# EAGLE design draftBoard (EAGLE 6.6.0)
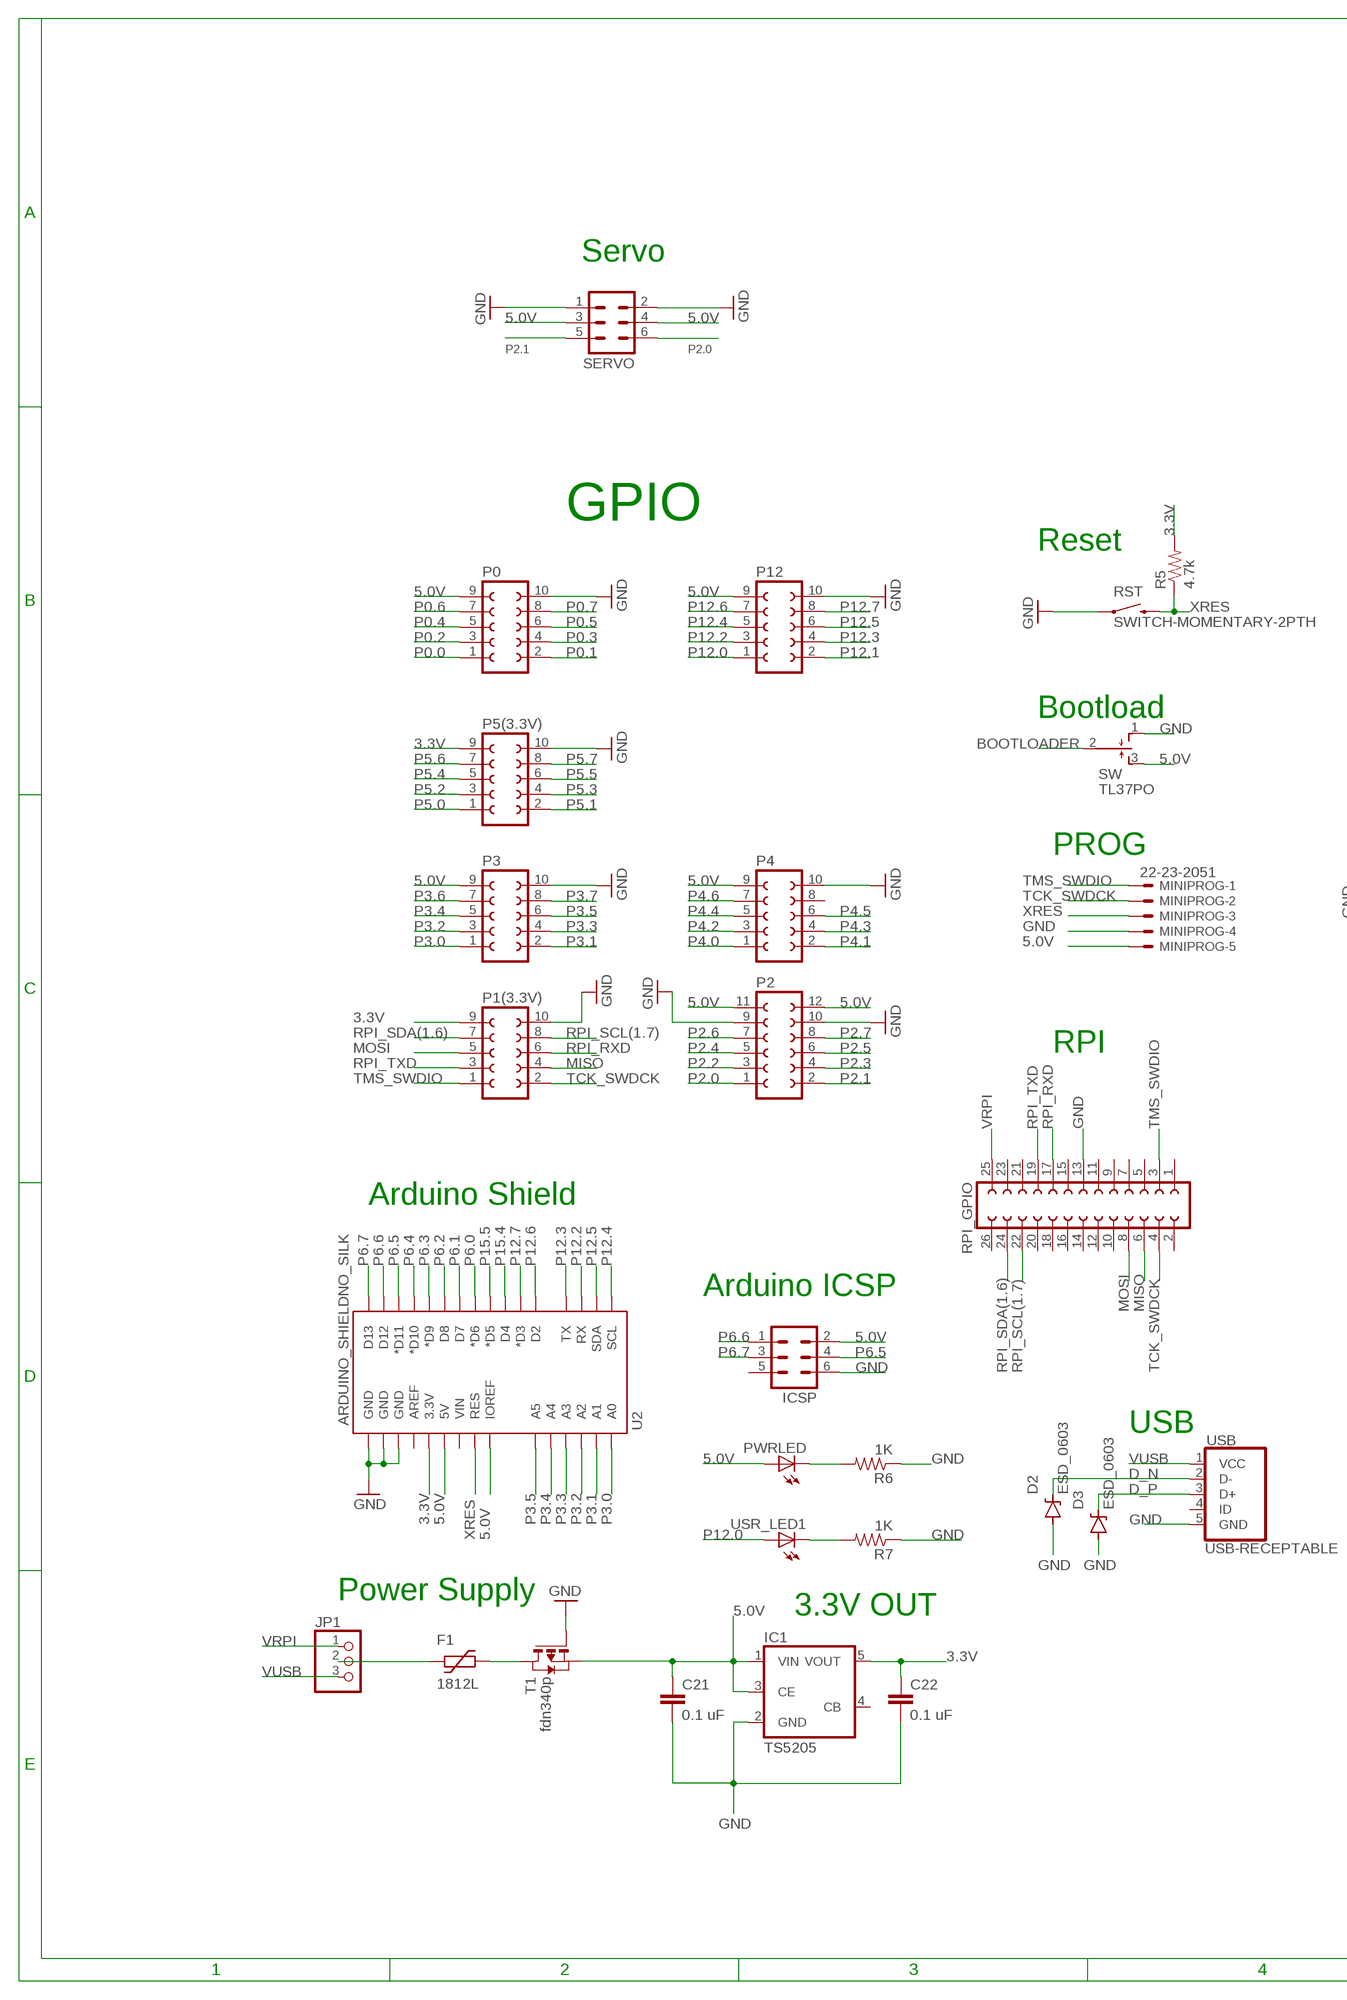
[diagram p0: schematic, sheet 1, part 1 of 2]
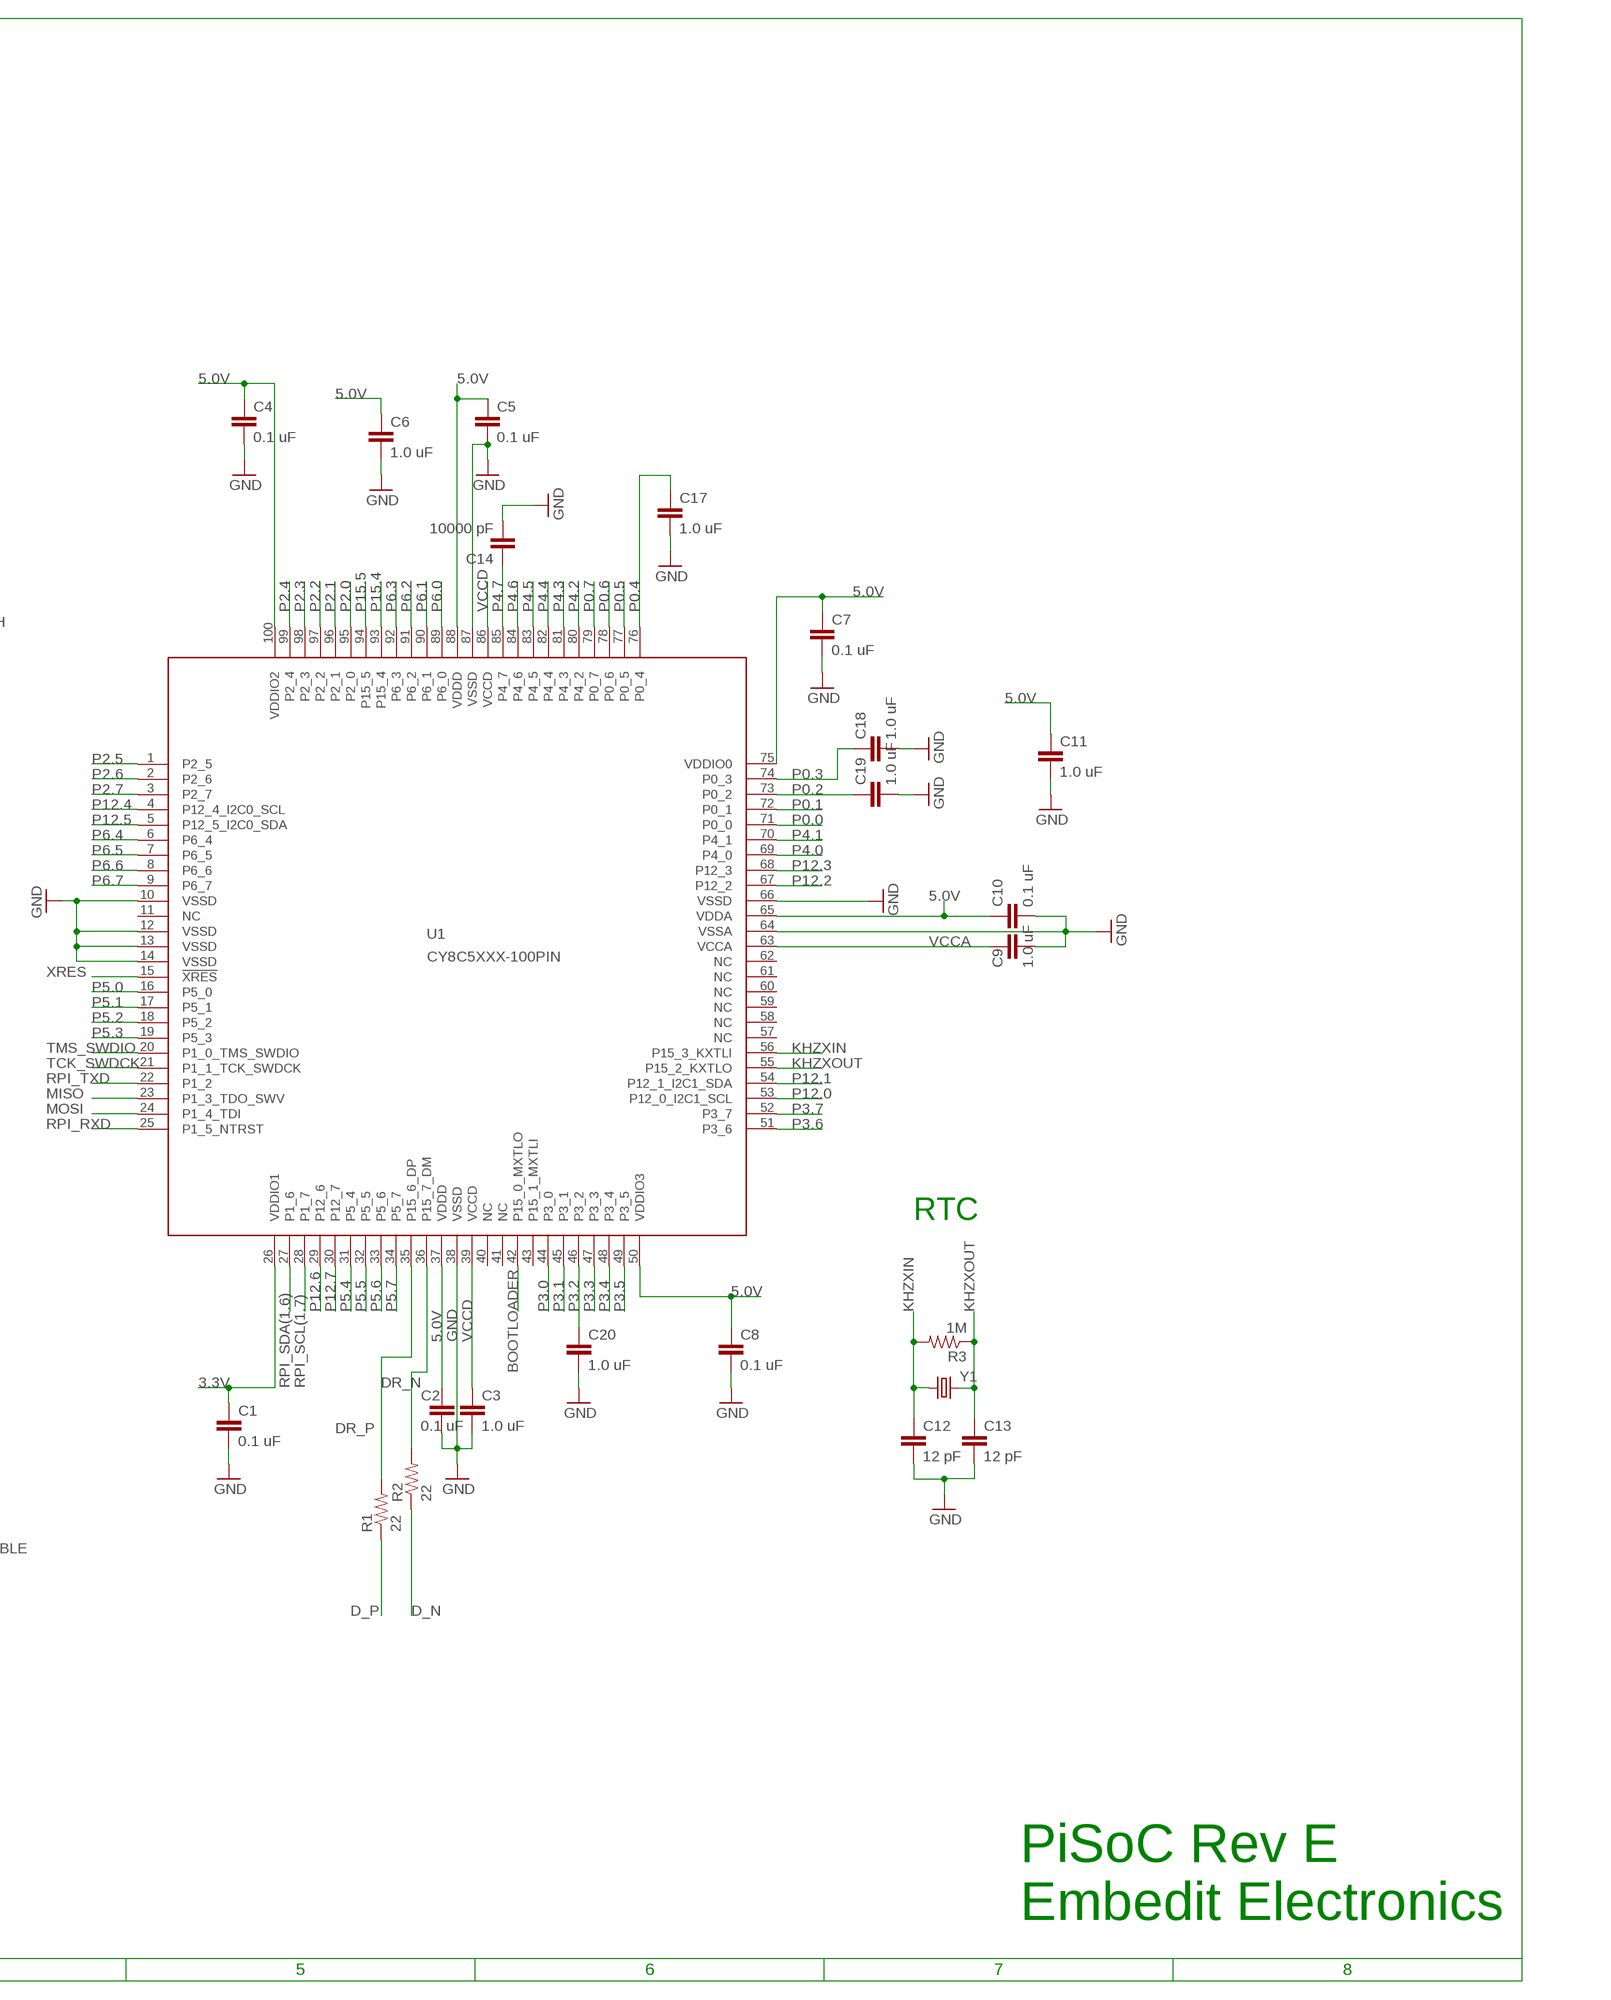
[diagram p1: schematic, sheet 1, part 2 of 2]

## Parts
C1  0.1 uF  CAP0603-CAP  [0603-CAP@1]
C2  0.1 uF  CAP0603-CAP  [0603-CAP@1]
C3  1.0 uF  CAP0603-CAP  [0603-CAP@1]
C4  0.1 uF  CAP0603-CAP  [0603-CAP@1]
C5  0.1 uF  CAP0603-CAP  [0603-CAP@1]
C6  1.0 uF  CAP0603-CAP  [0603-CAP@1]
C7  0.1 uF  CAP0603-CAP  [0603-CAP@1]
C8  0.1 uF  CAP0603-CAP  [0603-CAP@1]
C9  1.0 uF  CAP0603-CAP  [0603-CAP@1]
C10  0.1 uF  CAP0603-CAP  [0603-CAP@1]
C11  1.0 uF  CAP0603-CAP  [0603-CAP@1]
C12  12 pF  CAP0603-CAP  [0603-CAP@1]
C13  12 pF  CAP0603-CAP  [0603-CAP@1]
C14  10000 pF  CAP0603-CAP  [0603-CAP@1]
C17  1.0 uF  CAP0603-CAP  [0603-CAP@1]
C18  1.0 uF  CAP0603-CAP  [0603-CAP@1]
C19  1.0 uF  CAP0603-CAP  [0603-CAP@1]
C20  1.0 uF  CAP0603-CAP  [0603-CAP@1]
C21  0.1 uF  CAP0603-CAP  [0603-CAP@1]
C22  0.1 uF  CAP0603-CAP  [0603-CAP@1]
D2  ESD_0603  [0603-CAP]
D3  ESD_0603  [0603-CAP]
F1  1812L  [1812L]
IC1  TS5205  [SOT25]
ICSP  MA03-2  [MA03-2]
JP1  PINHD-1X3  [1X03]
MINIPROG  22-23-2051  [22-23-2051]
P0  FE05-2  [FE05-2]
P1(3.3V)  FE05-2  [FE05-2]
P2  FE06-2  [FE06-2]
P3  FE05-2  [FE05-2]
P4  FE05-2  [FE05-2]
P5(3.3V)  FE05-2  [FE05-2]
P12  FE05-2  [FE05-2]
PWRLED  LED0603  [LED-0603]
R1  22  RESISTOR0603-RES  [0603-RES]
R2  22  RESISTOR0603-RES  [0603-RES]
R3  1M  RESISTOR0603-RES  [0603-RES]
R5  4.7k  RESISTOR0603-RES  [0603-RES]
R6  1K  RESISTOR0603-RES  [0603-RES]
R7  1K  RESISTOR0603-RES  [0603-RES]
RPI_GPIO  FE13-2  [FE13-2]
RST  SWITCH-MOMENTARY-2PTH  [TACTILE-PTH]
SERVO  MA03-2  [MA03-2]
SW  TL37PO  [TL3XPO]
T1  fdn340p  PMOSSOT23  [SOT-23]
U1  CY8C5XXX-100PIN  [TQFP-14X14-100]
U2  ARDUINO_SHIELDNO_SILK  [DUEMILANOVE_VIAS]
USB  USB-RECEPTABLE  [FCI-10103594-0001LF]
USR_LED1  LED0603  [LED-0603]
Y1  CRYSTALTC26H  [TC26H]

## Nets
3.3V: C1.1 C22.1 IC1.5(VOUT) P1(3.3V).9 P5(3.3V).9 R5.2 U1.26(VDDIO1) U2.3.3V
5.0V: C2.1 C4.1 C5.1 C6.1 C7.1 C8.1 C10.1 C11.1 C21.1 IC1.1(VIN) IC1.3(CE) ICSP.2 MINIPROG.5 P0.9 P2.11 P2.12 P3.9 P4.9 P12.9 PWRLED.A SERVO.3 SERVO.4 SW.3(S) T1.2(S) U1.37(VDDD) U1.50(VDDIO3) U1.65(VDDA) U1.75(VDDIO0) U1.88(VDDD) U1.100(VDDIO2) U2.5V U2.IOREF
BOOTLOADER: SW.2(P) U1.42(P15_0_MXTLO)
D_N: D2.1(C) R2.1 USB.2(D-)
D_P: D3.1(C) R1.1 USB.3(D+)
DR_N: R2.2 U1.36(P15_7_DM)
DR_P: R1.2 U1.35(P15_6_DP)
GND: C1.2 C2.2 C3.2 C4.2 C5.2 C6.2 C7.2 C8.2 C9.2 C10.2 C11.2 C12.2 C13.2 C14.2 C17.2 C18.2 C19.2 C20.2 C21.2 C22.2 D2.2(A) D3.2(A) IC1.2(GND) ICSP.6 MINIPROG.4 P0.10 P1(3.3V).10 P2.9 P2.10 P3.10 P4.10 P5(3.3V).10 P12.10 R6.1 R7.1 RPI_GPIO.13 RST.1 SERVO.1 SERVO.2 SW.1(O) T1.3(G) U1.10(VSSD) U1.12(VSSD) U1.13(VSSD) U1.14(VSSD) U1.38(VSSD) U1.64(VSSA) U1.66(VSSD) U1.87(VSSD) U2.GND@0(GND) U2.GND@1(GND) U2.GND@2(GND) USB.5(GND)
KHZXIN: C12.1 R3.2 U1.56(P15_3_KXTLI) Y1.1
KHZXOUT: C13.1 R3.1 U1.55(P15_2_KXTLO) Y1.2
MISO: P1(3.3V).4 RPI_GPIO.6 U1.23(P1_3_TDO_SWV)
MOSI: P1(3.3V).5 RPI_GPIO.8 U1.24(P1_4_TDI)
N$2: PWRLED.C R6.2
N$3: F1.P$1 JP1.2
N$4: F1.P$2 T1.1(D)
N$6: R7.2 USR_LED1.C
P0.0: P0.1 U1.71(P0_0)
P0.1: P0.2 U1.72(P0_1)
P0.2: C19.1 P0.3 U1.73(P0_2)
P0.3: C18.1 P0.4 U1.74(P0_3)
P0.4: C17.1 P0.5 U1.76(P0_4)
P0.5: P0.6 U1.77(P0_5)
P0.6: P0.7 U1.78(P0_6)
P0.7: P0.8 U1.79(P0_7)
P2.0: P2.1 SERVO.6 U1.95(P2_0)
P2.1: P2.2 SERVO.5 U1.96(P2_1)
P2.2: P2.3 U1.97(P2_2)
P2.3: P2.4 U1.98(P2_3)
P2.4: P2.5 U1.99(P2_4)
P2.5: P2.6 U1.1(P2_5)
P2.6: P2.7 U1.2(P2_6)
P2.7: P2.8 U1.3(P2_7)
P3.0: P3.1 U1.44(P3_0) U2.A0
P3.1: P3.2 U1.45(P3_1) U2.A1
P3.2: C20.1 P3.3 U1.46(P3_2) U2.A2
P3.3: P3.4 U1.47(P3_3) U2.A3
P3.4: P3.5 U1.48(P3_4) U2.A4
P3.5: P3.6 U1.49(P3_5) U2.A5
P3.6: P3.7 U1.51(P3_6)
P3.7: P3.8 U1.52(P3_7)
P4.0: P4.1 U1.69(P4_0)
P4.1: P4.2 U1.70(P4_1)
P4.2: P4.3 U1.80(P4_2)
P4.3: P4.4 U1.81(P4_3)
P4.4: P4.5 U1.82(P4_4)
P4.5: P4.6 U1.83(P4_5)
P4.6: P4.7 U1.84(P4_6)
P4.7: C14.1 U1.85(P4_7)
P5.0: P5(3.3V).1 U1.16(P5_0)
P5.1: P5(3.3V).2 U1.17(P5_1)
P5.2: P5(3.3V).3 U1.18(P5_2)
P5.3: P5(3.3V).4 U1.19(P5_3)
P5.4: P5(3.3V).5 U1.31(P5_4)
P5.5: P5(3.3V).6 U1.32(P5_5)
P5.6: P5(3.3V).7 U1.33(P5_6)
P5.7: P5(3.3V).8 U1.34(P5_7)
P6.0: U1.89(P6_0) U2.D6(*D6)
P6.1: U1.90(P6_1) U2.D7
P6.2: U1.91(P6_2) U2.D8
P6.3: U1.92(P6_3) U2.D9(*D9)
P6.4: U1.6(P6_4) U2.D10(*D10)
P6.5: ICSP.4 U1.7(P6_5) U2.D11(*D11)
P6.6: ICSP.1 U1.8(P6_6) U2.D12
P6.7: ICSP.3 U1.9(P6_7) U2.D13
P12.0: P12.1 U1.53(P12_0_I2C1_SCL) USR_LED1.A
P12.1: P12.2 U1.54(P12_1_I2C1_SDA)
P12.2: P12.3 U1.67(P12_2) U2.RX
P12.3: P12.4 U1.68(P12_3) U2.TX
P12.4: P12.5 U1.4(P12_4_I2C0_SCL) U2.SCL
P12.5: P12.6 U1.5(P12_5_I2C0_SDA) U2.SDA
P12.6: P12.7 U1.29(P12_6) U2.D2
P12.7: P12.8 U1.30(P12_7) U2.D3(*D3)
P15.4: U1.93(P15_4) U2.D4
P15.5: U1.94(P15_5) U2.D5(*D5)
RPI_RXD: P1(3.3V).6 RPI_GPIO.17 U1.25(P1_5_NTRST)
RPI_SCL(1.7): P1(3.3V).8 RPI_GPIO.22 U1.28(P1_7)
RPI_SDA(1.6): P1(3.3V).7 RPI_GPIO.24 U1.27(P1_6)
RPI_TXD: P1(3.3V).3 RPI_GPIO.19 U1.22(P1_2)
TCK_SWDCK: MINIPROG.2 P1(3.3V).2 RPI_GPIO.4 U1.21(P1_1_TCK_SWDCK)
TMS_SWDIO: MINIPROG.1 P1(3.3V).1 RPI_GPIO.3 U1.20(P1_0_TMS_SWDIO)
VCCA: C9.1 U1.63(VCCA)
VCCD: C3.1 U1.39(VCCD) U1.86(VCCD)
VRPI: JP1.1 RPI_GPIO.25
VUSB: JP1.3 USB.1(VCC)
XRES: MINIPROG.3 R5.1 RST.3 U1.15(!XRES!) U2.RES
Unconnected: IC1.4(CB) ICSP.5 P4.8 RPI_GPIO.1 RPI_GPIO.2 RPI_GPIO.5 RPI_GPIO.7 RPI_GPIO.9 RPI_GPIO.10 RPI_GPIO.11 RPI_GPIO.12 RPI_GPIO.14 RPI_GPIO.15 RPI_GPIO.16 RPI_GPIO.18 RPI_GPIO.20 RPI_GPIO.21 RPI_GPIO.23 RPI_GPIO.26 U1.11(NC) U1.40(NC) U1.41(NC) U1.43(P15_1_MXTLI) U1.57(NC) U1.58(NC) U1.59(NC) U1.60(NC) U1.61(NC) U1.62(NC) U2.AREF U2.VIN USB.4(ID)

## Notes on the sheet
- Servo
- GPIO
- Reset
- Bootload
- PROG
- RPI
- Arduino Shield
- RTC
- Arduino ICSP
- USB
- Power Supply
- 3.3V OUT
- PiSoC Rev E
  Embedit Electronics

## Library data of the parts
C1-C14 C17-C22 = SparkFun-Capacitors:CAP: Capacitor Standard 0603 ceramic capacitor, and 0.1" leaded capacitor.
D2 D3 = SparkFun-Capacitors:ESD_0603
F1 = ptc-littlefuse:1812L
IC1 = v-reg:TS5205: 150mA Low Noise LDO Voltage Regulator with Enable TSC [Taiwan Semiconductor Company, Ltd] Source: http://www.taiwansemi.com .. 5205_0409c.pdf
ICSP SERVO = con-lstb:MA03-2: PIN HEADER; OC_FARNELL: unknown; OC_NEWARK: unknown
JP1 = pinhead:PINHD-1X3: PIN HEADER
MINIPROG = con-molex:22-23-2051: .100" (2.54mm) Center Header - 5 Pin; MF: MOLEX; MPN: 22-23-2051; OC_FARNELL: 1462952; OC_NEWARK: 38C9178
P0 P1(3.3V) P3 P4 P5(3.3V) P12 = con-lsta:FE05-2: FEMALE HEADER; OC_FARNELL: unknown; OC_NEWARK: unknown
P2 = con-lsta:FE06-2: FEMALE HEADER; OC_FARNELL: unknown; OC_NEWARK: unknown
PWRLED USR_LED1 = SparkFun-LED:LED: LEDs Standard schematic elements and footprints for 5mm, 3mm, 1206, and 0603 sized LEDs. 5mm - Spark Fun Electronics SKU : COM-00529 (and others)
R1-R3 R5-R7 = SparkFun-Passives:RESISTOR: Resistor Basic schematic elements and footprints for 0603, 1206, and PTH resistors.
RPI_GPIO = con-lsta:FE13-2: FEMALE HEADER; OC_FARNELL: unknown; OC_NEWARK: unknown
RST = SparkFun-Electromechanical:SWITCH-MOMENTARY-2: Various NO switches- pushbuttons, reed, etc
SW = switch:TL37PO: TINY SWITCH MOM OFF MOM Source: http://www2.produktinfo.conrad.com/datenblaetter/700000-724999/705152-da-01-de-Subminiaturschalter_TL_36YO.pdf
T1 = zetex:PMOSSOT23: MOS FET; OC_FARNELL: unknown; OC_NEWARK: unknown
U1 = cypress_psoc_V1_0:CY8C5XXX-100PIN: Cypress PSoC® 5 - Programmable System on Chip, ARM Cortex-M3 Based Source Data: http://www.cypress.com/?mpn=CY8C5588AXI-060 LBR Source: http://www.westmarkelectronics.com Thomas W. Moxon Director of Engineering www.westmarkelectronics.com; MPN: CY8C5588AXI-060
U2 = SparkFun-Boards:ARDUINO_SHIELD: Arduino shield footprint
USB = daspilker_2:USB-RECEPTABLE: USB Receptable
Y1 = SparkFun-FreqCtrl:CRYSTAL: Various standard crystals. Proven footprints. Spark Fun Electronics SKU : COM-00534

## Board
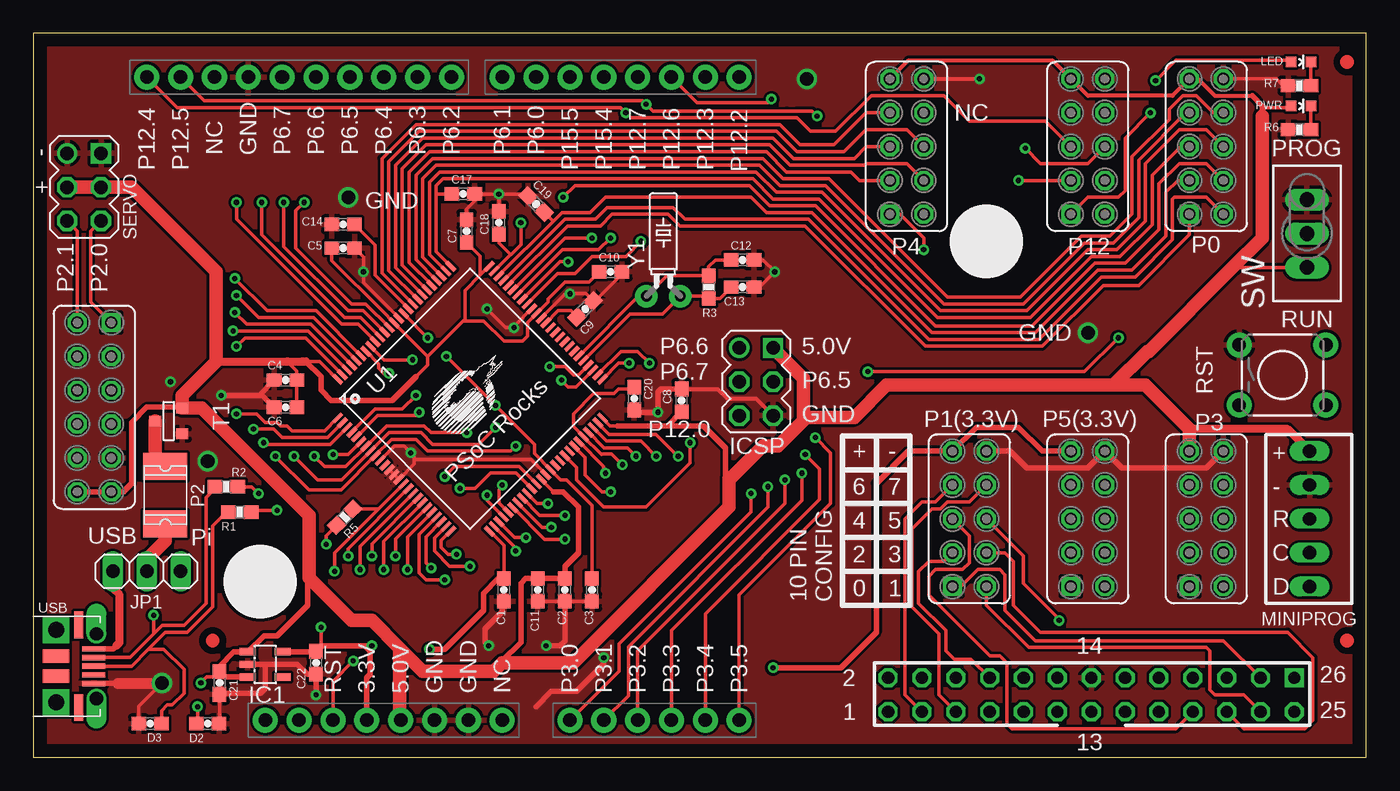
[diagram p2: board, top side]
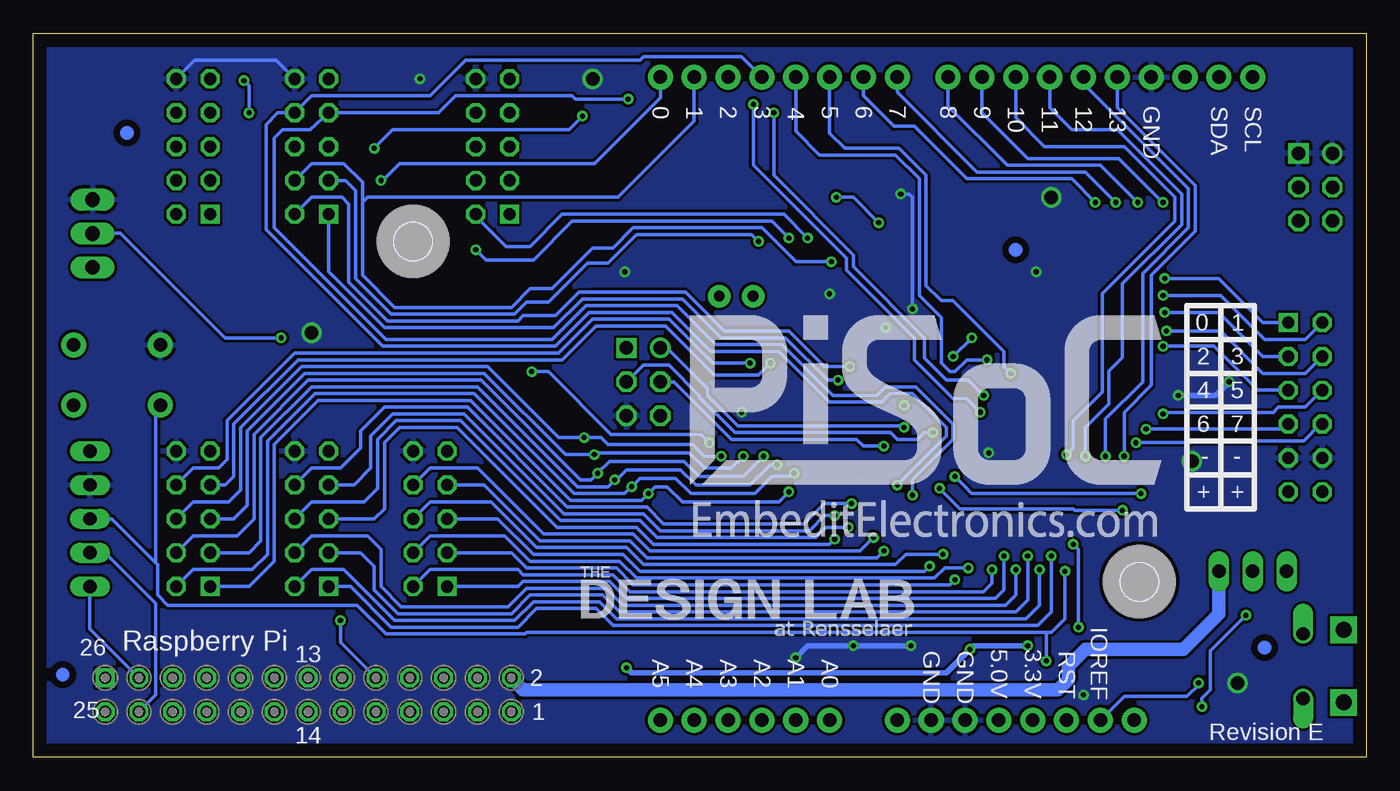
[diagram p3: board, bottom side, seen from below]

Size 100 x 54.35 mm. Coordinates in mm from the lower left corner, seen from the top.
Outline: 0,0 100,0 100,54.35 0,54.35 0,0
Copper layers (1*16): Top 0.035mm / dielectric 1.5mm / Bottom 0.035mm
Design rules "default *": minimum track width 10mil, minimum drill 24mil, track to track 8mil, track to pad 8mil, pad to pad 8mil, via to via 8mil, smd to smd 8mil, copper to edge 40mil, drill to drill 8mil, minimum pad ring 10mil, minimum via ring 8mil, stop-mask expansion 4mil, vias tented up to drill 16mil, thermal gap 10mil
Holes 2.9 mm at 71.51,38.7 17.02,13.2
tRestrict: area 68.5,35.7 to 74.5,41.7; area 14,10.2 to 20,16.2
bRestrict: area 68.5,35.7 to 74.5,41.7; area 14,10.2 to 20,16.2

### Footprints (pad centres in the part's own frame; a part is rotated, then mirrored left to right if it is on the bottom)
0603-CAP@1 = smd 1.1 x 1: 1 -0.85,0; 2 0.85,0
0603-CAP = smd 1.1 x 1: 1 -0.85,0; 2 0.85,0
1812L = smd 2.03 x 3.3: P$1 -2.16,0; P$2 2.16,0
SOT25 = smd 0.55 x 1.2: 1 -0.95,-1.3; 2 0,-1.3; 3 0.95,-1.3; 4 0.95,1.3; 5 -0.95,1.3
MA03-2 = drill 1.016: 1 -2.54,-1.27 | drill 1.016 square: 2 -2.54,1.27 | drill 1.016 octagon: 3 0,-1.27; 4 0,1.27; 5 2.54,-1.27; 6 2.54,1.27
1X03 = drill 1.016 long: 1 -2.54,0; 2 0,0; 3 2.54,0
22-23-2051 = drill 1 long: 1 -5.08,0; 2 -2.54,0; 3 0,0; 4 2.54,0; 5 5.08,0
FE05-2 = drill 0.914 square: 1 -5.08,1.27 | drill 0.914 octagon: 2 -5.08,-1.27; 3 -2.54,1.27; 4 -2.54,-1.27; 5 0,1.27; 6 0,-1.27; 7 2.54,1.27; 8 2.54,-1.27; 9 5.08,1.27; 10 5.08,-1.27
FE06-2 = drill 0.914 square: 1 -6.35,1.27 | drill 0.914 octagon: 2 -6.35,-1.27; 3 -3.81,1.27; 4 -3.81,-1.27; 5 -1.27,1.27; 6 -1.27,-1.27; 7 1.27,1.27; 8 1.27,-1.27; 9 3.81,1.27; 10 3.81,-1.27; 11 6.35,1.27; 12 6.35,-1.27
LED-0603 = smd 0.8 x 0.8: A 0,-0.75; C 0,0.75
0603-RES = smd 1.1 x 1: 1 -0.85,0; 2 0.85,0
FE13-2 = drill 0.914 square: 1 -15.24,1.27 | drill 0.914 octagon: 2 -15.24,-1.27; 3 -12.7,1.27; 4 -12.7,-1.27; 5 -10.16,1.27; 6 -10.16,-1.27; 7 -7.62,1.27; 8 -7.62,-1.27; 9 -5.08,1.27; 10 -5.08,-1.27; 11 -2.54,1.27; 12 -2.54,-1.27; 13 0,1.27; 14 0,-1.27; 15 2.54,1.27; 16 2.54,-1.27; 17 5.08,1.27; 18 5.08,-1.27; 19 7.62,1.27; 20 7.62,-1.27; 21 10.16,1.27; 22 10.16,-1.27; 23 12.7,1.27; 24 12.7,-1.27; 25 15.24,1.27; 26 15.24,-1.27
TACTILE-PTH = drill 1.016 pad 1.88: 1 -3.251,2.261; 2 3.251,2.261; 3 -3.251,-2.261; 4 3.251,-2.261
TL3XPO = drill 1.1 pad 1.422 long: 1 -2.54,0; 2 0,0; 3 2.54,0
SOT-23 = smd 0.787 x 0.889: 1 0.025,-1.016; 2 -0.94,1.016; 3 0.991,1.016
TQFP-14X14-100 = smd 0.9 x 0.3: 1 -8.05,6; 2 -8.05,5.5; 3 -8.05,5; 4 -8.05,4.5; 5 -8.05,4; 6 -8.05,3.5; 7 -8.05,3; 8 -8.05,2.5; 9 -8.05,2; 10 -8.05,1.5; 11 -8.05,1; 12 -8.05,0.5; 13 -8.05,0; 14 -8.05,-0.5; 15 -8.05,-1; 16 -8.05,-1.5; 17 -8.05,-2; 18 -8.05,-2.5; 19 -8.05,-3; 20 -8.05,-3.5; 21 -8.05,-4; 22 -8.05,-4.5; 23 -8.05,-5; 24 -8.05,-5.5; 25 -8.05,-6; 51 8.05,-6; 52 8.05,-5.5; 53 8.05,-5; 54 8.05,-4.5; 55 8.05,-4; 56 8.05,-3.5; 57 8.05,-3; 58 8.05,-2.5; 59 8.05,-2; 60 8.05,-1.5; 61 8.05,-1; 62 8.05,-0.5; 63 8.05,0; 64 8.05,0.5; 65 8.05,1; 66 8.05,1.5; 67 8.05,2; 68 8.05,2.5; 69 8.05,3; 70 8.05,3.5; 71 8.05,4; 72 8.05,4.5; 73 8.05,5; 74 8.05,5.5; 75 8.05,6 | smd 0.3 x 0.9: 26 -6,-8.05; 27 -5.5,-8.05; 28 -5,-8.05; 29 -4.5,-8.05; 30 -4,-8.05; 31 -3.5,-8.05; 32 -3,-8.05; 33 -2.5,-8.05; 34 -2,-8.05; 35 -1.5,-8.05; 36 -1,-8.05; 37 -0.5,-8.05; 38 0,-8.05; 39 0.5,-8.05; 40 1,-8.05; 41 1.5,-8.05; 42 2,-8.05; 43 2.5,-8.05; 44 3,-8.05; 45 3.5,-8.05; 46 4,-8.05; 47 4.5,-8.05; 48 5,-8.05; 49 5.5,-8.05; 50 6,-8.05; 76 6,8.05; 77 5.5,8.05; 78 5,8.05; 79 4.5,8.05; 80 4,8.05; 81 3.5,8.05; 82 3,8.05; 83 2.5,8.05; 84 2,8.05; 85 1.5,8.05; 86 1,8.05; 87 0.5,8.05; 88 0,8.05; 89 -0.5,8.05; 90 -1,8.05; 91 -1.5,8.05; 92 -2,8.05; 93 -2.5,8.05; 94 -3,8.05; 95 -3.5,8.05; 96 -4,8.05; 97 -4.5,8.05; 98 -5,8.05; 99 -5.5,8.05; 100 -6,8.05
DUEMILANOVE_VIAS = drill 1.016 pad 1.88: 3.3V 50.8,13.97; 5V 50.8,16.51; A0 50.8,29.21; A1 50.8,31.75; A2 50.8,34.29; A3 50.8,36.83; A4 50.8,39.37; A5 50.8,41.91; AREF 2.54,2.54; D2 2.54,36.83; D3 2.54,34.29; D4 2.54,31.75; D5 2.54,29.21; D6 2.54,26.67; D7 2.54,24.13; D8 2.54,20.32; D9 2.54,17.78; D10 2.54,15.24; D11 2.54,12.7; D12 2.54,10.16; D13 2.54,7.62; DNC 50.8,6.35; GND@0 50.8,19.05; GND@1 50.8,21.59; GND@2 2.54,5.08; IOREF 50.8,8.89; RES 50.8,11.43; RX 2.54,41.91; SCL 2.54,-2.54; SDA 2.54,0; TX 2.54,39.37; VIN 50.8,24.13
FCI-10103594-0001LF = smd 0.4 x 1.75: 1 -1.3,4.525; 2 -0.65,4.525; 3 0,4.525; 4 0.65,4.525; 5 1.3,4.525 | smd 2 x 0.7: 6 -3.1,3.4; 7 3.1,3.4 | drill 1 pad 1.27 offset: P$1 -2.425,4.73; P$2 2.425,4.73 | drill 1.2 pad 2 square: P$3 -2.725,1.7; P$4 2.725,1.7 | smd 1 x 2: P$5 0.75,1.7; P$6 -0.75,1.7
TC26H = drill 0.813 pad 1.676: 1 -1.27,0; 2 1.27,0

### Placement (x,y rotation side)
C1  35.31,12.57 270 top
C2  39.88,12.57 270 top
C3  41.91,12.57 270 top
C4  18.92,28.32 180 top
C5  23.24,38.23 0 top
C6  18.92,26.29 180 top
C7  32.51,39.5 90 top
C8  48.64,26.8 90 top
C9  41.4,33.66 45 top
C10  43.31,36.45 0 top
C11  37.85,12.57 270 top
C12  53.21,37.34 0 top
C13  53.21,35.31 0 top
C14  23.24,40.01 180 top
C17  32.26,42.29 0 top
C18  34.92,40.13 90 top
C19  37.72,41.53 135 top
C20  45.09,26.92 270 top
C21  13.97,5.59 270 top
C22  21.21,7.11 270 top
D2  13.08,2.54 0 top
D3  8.76,2.54 180 top
F1  9.91,19.68 90 top
IC1  17.4,6.99 270 top
ICSP  54.23,28.19 270 top
JP1  8.51,13.97 180 top
MINIPROG  95.76,17.91 90 top
P0  88.01,45.85 90 top
P1(3.3V)  70.23,17.91 90 top
P2  4.57,26.29 270 top
P3  88.01,17.91 90 top
P4  65.53,45.85 90 top
P5(3.3V)  79.12,17.91 90 top
P12  79.12,45.85 90 top
PWRLED  95.12,48.9 270 top
R1  15.49,18.41 0 top
R2  14.48,20.32 0 top
R3  50.67,35.31 90 top
R5  23.37,18.03 225 top
R6  95,47.12 0 top
R7  95,50.42 0 top
RPI_GPIO  79.38,4.7 0 bottom
RST  93.73,28.7 0 top
SERVO  3.81,42.8 270 top
SW  95.55,39.32 270 top
T1  10.16,25.27 270 top
U1  32.77,26.92 45 top
U2  11.05,53.59 270 top
U$1  [PISOC_LOGO_BOTTOM_MEDIUM]  15.37,15.62 0 top
U$2  [DESIGN_LAB_LOGO_SMALL]  59.05,9.02 0 bottom
U$3  [12PINPORT]  10.92,26.29 0 top
U$4  [10PINPORT]  63.25,19.05 0 top
U$6  [CIRCLE-1MM-2R]  13.46,8.76 0 top
U$7  [CIRCLE-1MM-2R]  98.55,52.2 0 top
U$8  [CIRCLE-1MM-2R]  98.55,8.76 0 top
U$9  [CIRCLE-1MM-2R]  7.62,8.26 0 bottom
U$10  [CIRCLE-1MM-2R]  92.96,46.86 0 bottom
U$11  [CIRCLE-1MM-2R]  26.29,38.1 0 bottom
U$12  [CIRCLE-1MM-2R]  97.79,6.22 0 bottom
USB  0,6.86 270 top
USR_LED1  95.12,52.2 270 top
Y1  47.27,34.62 0 top

### Tracks (layer width: path | path; a pad name or v marks a point on that pad's centre or on a via)
3.3V  (via drill 0.38)
  Top 0.254: C1.1 35.31,15.9 U1.26 | 21.63,8.38 21.59,8.42 v21.59,9.78 | v21.97,16 21.97,16.64 R5.2
  Top 0.406: P5(3.3V).9 75.69,22.99 73.91,24.77 70.74,24.77 P1(3.3V).9 65.66,22.99 63.25,20.57 63.25,9.4 60.58,6.73 v55.5,6.73 | 24.89,8.38 21.63,8.38 C22.1 21.18,7.93 IC1.5 | 24.89,8.38 v25.4,8.38 | v29.72,8.13 30.86,8.13 33.78,11.05 33.78,12.32 34.89,13.42 C1.1 | U2.3.3V 25.02,5.97 25.27,6.22 25.27,8 24.89,8.38
  Bottom 0.254: v21.59,9.78 21.59,15.62 v21.97,16
  Bottom 0.406: v25.4,8.38 29.46,8.38 v29.72,8.13 31.5,6.35 55.12,6.35 v55.5,6.73
5.0V  (via drill 0.38)  (1 unrouted)
  Top 0.254: U1.37 39.04,19.94 | 22.35,28.83 22.86,28.32 22.86,28.34 U1.100 21.49,29.72 20.19,29.72 | U1.75 34.19,36.86 33.53,36.2 | 33.53,36.2 32.38,35.05 32.38,32.89 32.26,32.77 | C7.1 33.53,37.63 33.53,36.2 | U1.50 43.28,24.89 43.81,24.89 | 92.33,48.77 94.25,48.77 PWRLED.A | 28.7,28.57 29.59,29.46 29.59,30.1 | C5.1 22.39,37.3 26.16,33.53 U1.88 27.69,32 29.59,30.1 | 32.26,32.77 29.59,30.1 | C10.1 41.7,35.69 39.88,35.69 38.61,34.42 38.61,34.18 U1.65 37.08,32.66 37.08,31.62 36.7,31.24 35.31,31.24 33.78,32.77 32.26,32.77 | 35.18,7.24 35.18,7.11 | C6.1 C4.1 19.77,29 19.05,29.72 | SW.3 90.09,36.78 90.04,36.83 | C21.1 13.57,6.04 13.02,6.04 v12.57,5.59
  Top 0.305: P4.9 65.66,52.32 76.45,52.32 P12.9 79.12,49.66 85.47,49.66 P0.9 87.38,50.93 88.65,49.66 91.44,49.66
  Top 0.406: 39.04,19.94 39.75,19.94 40.89,18.8 40.89,15.37 39.88,14.35 C2.1 C11.1 36.92,13.42 36.58,13.08 36.58,8.64 35.18,7.24 | 91.44,49.66 92.2,48.9 | 92.2,48.9 92.33,48.77 | 20.45,29.72 21.59,28.57 21.59,27.56 22.35,26.8 26.92,26.8 28.7,28.57 | 43.81,24.89 47.59,24.89 | 47.59,24.89 C8.1 | IC1.3 14.37,6.04 C21.1 13.97,6.86 15.05,7.93 IC1.1 17.31,9.14 18.29,9.14 20.57,11.43 20.57,13.46 20.7,13.59 | P2.12 P2.11 6.73,19.94 7.37,20.57 7.37,25.15 8.51,26.29 11.1,26.29 T1.2 | 52.2,20.95 51.94,20.95 51.94,23.24 50.29,24.89 47.59,24.89 | 92.2,48.13 92.2,48.9
  Top 0.61: 13.72,29.72 19.05,29.72 20.19,29.72 20.45,29.72 | MINIPROG.5 94.11,24.64 86.74,24.64
  Top 1.016: 27.5,8.19 29.21,6.48 34.54,6.48 35.18,7.11 40.51,7.11 52.2,18.8 52.2,20.95 52.32,20.95 54.74,23.37 55.88,23.37 57.78,25.27 57.78,25.53 | 27.5,8.19 25.4,10.29 23.88,10.29 20.7,13.46 20.7,13.59 20.7,18.16 12.65,26.21 T1.2 11.18,27.18 13.72,29.72 13.72,36.45 7.37,42.8 SERVO.4 SERVO.3 | 57.78,25.53 61.59,25.53 64.01,27.94 81.03,27.94 | 81.03,27.94 83.44,27.94 86.74,24.64 P3.9 | 57.78,25.53 57.78,28.45 ICSP.2 | U2.5V 27.5,2.86 27.5,8.19 | 81.03,27.94 83.57,30.48 83.69,30.48 90.04,36.83 92.2,38.99 92.2,48.13
  Bottom 0.254: U2.IOREF 18.16,4.57 13.46,4.57 12.57,5.46 v12.57,5.59
BOOTLOADER  (via drill 0.38)
  Top 0.254: U1.42 40.77,21.75 40.77,20.83 42.8,18.8 45.97,18.8 49.28,22.1 v49.28,23.62 | v62.61,28.96 78.87,28.96 v81.41,31.5
  Bottom 0.254: v49.28,23.62 49.91,24.26 56.64,24.26 61.34,28.96 v62.61,28.96 | v81.41,31.5 85.6,31.5 93.47,39.37 95.5,39.37 SW.2
D_N  (via drill 0.38)
  Top 0.254: 9.02,9.27 7.25,7.51 USB.2 | 9.02,9.27 9.65,9.91 11.3,9.91 12.95,11.56 12.95,19.52 13.1,19.67 13.63,20.19 R2.1 | D2.1 12.32,2.54 v12.32,3.81 | v9.02,10.67 9.02,9.27
  Bottom 0.254: v9.02,10.67 11.68,8 11.68,5.08 12.32,4.45 v12.32,3.81
D_P
  Top 0.254: 8.64,8.13 7.37,6.86 USB.3 | 8.64,8.13 9.91,9.4 11.56,9.4 13.46,11.3 13.46,17.36 14.52,18.41 R1.1 | D3.1 9.61,3.52 10.03,3.94 10.41,3.94 11.3,4.83 11.3,6.6 9.78,8.13 8.64,8.13
DR_N  (via drill 0.38)
  Top 0.254: U1.36 36.43,21.84 31.62,21.84 v30.86,21.08 | R2.2 16.38,20.32 v16.89,19.81
  Bottom 0.254: v30.86,21.08 29.97,20.19 29.72,19.94 29.59,19.81 v16.89,19.81
DR_P  (via drill 0.38)
  Top 0.254: U1.35 36.23,21.34 34.29,21.34 33.15,20.19 v32,20.19 | R1.2 16.47,18.54 v18.29,18.54
  Bottom 0.254: v18.29,18.54 21.84,18.54 21.97,18.67 30.48,18.67 v32,20.19
GND  (via drill 0.38, 1.02)
  Top 0.254: U1.10 27.09,23.37 27.81,23.37 v28.32,22.86 28.57,22.61 28.57,22.35 | 28.57,22.35 28.57,22.03 U1.14 U1.13 U1.12 | C7.2 32.51,41.15 33.11,41.74 C17.2 v34.92,42.29 | C10.2 44.16,36.28 42.13,34.26 C9.2 41.46,34.8 v40.26,34.8 39.93,34.8 U1.64 | C18.2 v34.92,42.29 | C19.2 | C3.2 C2.2 C11.2 | v34.92,42.29 37.12,42.29 C19.2 | U1.66 36.07,32.35 v36.07,32.26 35.43,32.26 v34.04,33.66 | 14.06,4.83 C21.2 13.97,2.58 D2.2 | C20.2 45.12,25.91 | C12.2 54.74,37.34 v55.63,36.45 54.48,35.31 C13.2 | P0.10 93.26,50.93 93.77,50.42 R7.1 | D3.2 7.91,3.85 v9.65,5.59 | U1.87 24.77,35.63 v24.77,36.45 24.77,37.55 C5.2 | 35.18,11.6 C1.2 | U1.38 37.34,22.35 28.57,22.35
  Top 0.305: P4.10 v70.99,50.93 | C8.2 51.35,27.65 52.07,26.92 54.23,26.92 ICSP.6
  Top 0.406: P1(3.3V).10 73.28,22.99 74.55,21.72 79.12,21.72 P5(3.3V).10 81.66,21.72 88.01,21.72 P3.10 | C2.2 39.88,8.76 39.5,8.38 v38.48,8.38 | USB.5 6.35,5.56 6.35,5.59 | 45.12,25.91 v46.86,25.91 46.86,27.43 47.08,27.65 C8.2 | v21.21,4.7 C22.2 21.17,6.22 20.57,6.22 19.81,6.99 17.27,6.99 | 17.27,6.99 IC1.2 | 14.06,4.83 17.02,4.83 17.4,5.21 17.4,6.86 17.27,6.99 | v14.1,27.18 16.93,27.18 | v34.16,8.38 33.91,8.64 33.91,9.65 35.18,10.92 35.18,11.6 | v42.8,7.49 42.8,6.99 40.77,4.95 38.86,4.95 37.72,3.81 | 16.93,27.18 C4.2 | 16.93,27.18 17.18,27.18 C6.2
  Top 0.61: 9.65,5.56 v9.65,5.59
  Top 0.813: 6.35,5.56 9.65,5.56
  Bottom 0.254: P0.10 87.88,52.32 81.79,52.32 P12.10 | v34.92,42.29 34.29,42.29 34.04,42.04 v34.04,33.66
  Bottom 0.406: v14.1,27.18 11.3,27.18 v10.29,28.19 | v34.16,8.38 v38.48,8.38 41.91,8.38 v42.8,7.49
  other vias: 58.04,50.93 79.12,31.88 23.62,42.04 13.08,22.23
  pour Bottom: -0.64,54.86 -0.64,-0.51 100.58,-0.76 100.71,55.12
  pour Top: -1.27,55.5 101.47,55.5 101.47,-1.52 -1.27,-1.52
KHZXIN
  Top 0.254: U1.56 45.41,34.62 Y1.1 47.53,36.16 R3.2 | R3.2 50.71,36.2 | C12.1 51.18,37.34 50.67,36.83 R3.2
KHZXOUT
  Top 0.254: U1.55 44.77,33.27 47.19,33.27 Y1.2 50.51,34.62 arc-90 R3.1 51.51,34.46 C13.1
MISO  (via drill 0.38)
  Top 0.254: U1.23 29.46,16.55 29.46,14.61 v29.84,14.22 | P1(3.3V).4 72.9,15.37 73.53,14.73 73.53,11.43 75.56,9.4 94.11,9.4 96.01,7.49 96.01,2.79 95.38,2.16 90.81,2.16 RPI_GPIO.6
  Bottom 0.254: v29.84,14.22 31.62,14.22 32.38,13.46 54.74,13.46 56.01,14.73 62.74,14.73 64.64,16.64 70.23,16.64 P1(3.3V).4
MOSI  (via drill 0.38)
  Top 0.254: U1.24 30.1,16.48 30.1,15.49 31.24,14.35 v32.77,14.35 | P1(3.3V).5 70.23,16.64 70.23,14.61 69.72,14.1 67.69,14.1 67.18,13.59 67.18,12.19 71.75,7.62 72.52,7.62 73.03,7.11 73.03,2.54 73.41,2.16 85.72,2.16 RPI_GPIO.8
  Bottom 0.254: v32.77,14.35 33.15,13.97 54.48,13.97 55.75,15.24 62.48,15.24 65.15,17.91 P1(3.3V).5
N$2
  Top 0.254: R6.2 95.85,48.87 PWRLED.C
N$3
  Top 1.016: JP1.2 8.51,14.86 9.91,16.26 F1.P$1
N$4
  Top 1.016: F1.P$2 9.14,22.61 T1.1
N$6
  Top 0.254: R7.2 95.85,51.92 USR_LED1.C
P0.0
  Top 0.254: U1.71 40.06,39.88 42.55,39.88 43.43,40.77 47.62,40.77 48.51,39.88 57.91,39.88 66.93,30.86 75.69,30.86 80.26,35.43 82.93,35.43 86.74,39.24 P0.1
P0.1
  Top 0.254: U1.72 38.09,38.61 38.1,38.61 39.88,40.39 42.16,40.39 43.05,41.27 48.01,41.27 48.9,40.39 58.17,40.39 67.18,31.37 75.44,31.37 80.14,36.07 82.68,36.07 85.47,38.86 85.47,41.91 85.6,42.04 88.01,42.04 P0.2
P0.2
  Top 0.254: P0.3 85.85,43.31 84.96,42.42 84.96,39.12 82.42,36.58 79.88,36.58 75.18,31.88 67.44,31.88 58.42,40.89 54.99,40.89 53.85,42.04 42.93,42.04 41.78,40.89 39.66,40.89 38.95,40.17 | 38.95,40.17 U1.73 | C19.1 38.95,40.3 38.95,40.17
P0.3  (via drill 0.38)
  Top 0.254: 35.8,37.73 U1.74 | C18.1 34.92,38.61 35.8,37.73 | 35.8,37.73 35.83,37.73 36.58,38.48 v36.58,40.13 | v39.75,42.04 40.64,42.93 53.72,42.93 55.24,41.4 58.67,41.4 67.69,32.38 74.93,32.38 79.63,37.08 81.92,37.08 84.45,39.62 84.45,43.05 85.98,44.58 88.01,44.58 P0.4
  Bottom 0.254: v36.58,40.13 38.48,42.04 v39.75,42.04
P0.4
  Top 0.254: 30.23,42.29 30.23,42.93 30.73,43.43 53.98,43.43 55.5,41.91 58.93,41.91 67.82,33.02 74.8,33.02 79.38,37.59 81.53,37.59 83.95,40.01 83.95,43.69 86.11,45.85 P0.5 | 30.23,42.29 30.23,37.95 U1.76 | C17.1 30.23,42.29
P0.5
  Top 0.254: U1.77 29.72,37.75 29.72,43.18 30.48,43.94 54.23,43.94 55.75,42.42 59.18,42.42 68.07,33.53 74.55,33.53 79.12,38.1 81.28,38.1 83.44,40.26 83.44,44.58 85.98,47.12 88.01,47.12 P0.6
P0.6
  Top 0.254: U1.78 29.21,37.55 29.21,43.43 30.23,44.45 54.48,44.45 56.01,42.93 59.44,42.93 68.33,34.04 74.3,34.04 78.87,38.61 81.03,38.61 82.93,40.51 82.93,44.83 86.49,48.39 P0.7
P0.7
  Top 0.254: U1.79 28.7,37.35 28.7,43.69 29.97,44.96 54.74,44.96 56.26,43.43 59.69,43.43 68.58,34.54 74.04,34.54 78.61,39.12 80.77,39.12 82.42,40.77 82.42,45.09 85.22,47.88 85.22,48.64 86.23,49.66 87.25,49.66 88.52,48.39 P0.8
P2.0  (via drill 0.38)
  Top 0.254: U1.95 21.21,33.53 17.53,33.53 v15.11,35.94 | SERVO.6 4.32,39.5 4.32,34.16 P2.1
  Bottom 0.254: v15.11,35.94 11.05,35.94 7.75,32.64 P2.1
P2.1  (via drill 0.38)
  Top 0.254: U1.96 21.01,33.02 16.89,33.02 v15.24,34.67 | SERVO.5 3.3,39.5 P2.2
  Bottom 0.254: v15.24,34.67 10.92,34.67 7.62,31.37 4.57,31.37 P2.2
P2.2  (via drill 0.38)
  Top 0.254: U1.97 20.81,32.51 16,32.51 v15.11,33.4
  Bottom 0.254: v15.11,33.4 11.05,33.4 7.75,30.1 P2.3
P2.3  (via drill 0.38)
  Top 0.254: U1.98 20.61,32 v14.99,32
  Bottom 0.254: v14.99,32 10.92,32 7.75,28.83 4.57,28.83 P2.4
P2.4  (via drill 0.38)
  Top 0.254: U1.99 20.42,31.5 15.88,31.5 v15.24,30.86
  Bottom 0.254: P2.5 8.13,27.56 11.43,30.86 v15.24,30.86
P2.5  (via drill 0.38)
  Top 0.254: U1.1 22.81,25.47 21.84,24.51 19.43,24.51 19.05,24.89 18.54,24.89 18.29,25.15 17.4,25.15 16.76,25.78 v15.24,25.78
  Bottom 0.254: P2.6 4.57,26.29 6.6,26.29 6.99,25.91 15.11,25.91 v15.24,25.78
P2.6  (via drill 0.38)
  Top 0.254: U1.2 22.07,24 18.67,24 18.03,24.64 v16.51,24.64
  Bottom 0.254: v16.51,24.64 6.22,24.64 P2.7
P2.7  (via drill 0.38)
  Top 0.254: U1.3 22.27,23.5 17.4,23.5 v17.27,23.62
  Bottom 0.254: P2.8 3.43,25.02 4.7,23.75 13.08,23.75 13.21,23.62 v17.27,23.62
P3.0  (via drill 0.38)
  Top 0.254: U1.44 41.4,22.53 41.4,21.21 42.67,19.94 v43.31,19.94 | v53.85,19.81 53.85,18.41 43.94,8.51 43.94,6.48 U2.A0
  Bottom 0.254: P3.1 83.82,12.83 81.92,14.73 81.92,23.5 78.61,26.8 67.18,26.8 59.69,19.3 54.36,19.3 v53.85,19.81 | v53.85,19.81 53.85,19.94 | v53.85,19.81 53.34,20.32 52.45,20.32 51.31,19.18 44.07,19.18 v43.31,19.94
P3.1  (via drill 0.38)
  Top 0.254: U1.45 42.8,21.84 42.8,21.47 v42.93,21.34 | v55.12,20.32 55.12,18.8 44.64,8.32 44.64,4.64 U2.A1
  Bottom 0.254: P3.2 88.01,14.1 83.57,14.1 82.42,15.24 82.42,23.75 78.87,27.3 66.93,27.3 59.44,19.81 55.63,19.81 v55.12,20.32 54.48,20.95 51.82,20.95 50.67,19.81 45.85,19.81 44.58,21.08 43.18,21.08 v42.93,21.34
P3.2  (via drill 0.38)
  Top 0.254: 42.61,22.73 42.58,22.77 | 42.58,22.77 U1.46 40.51,24.83 40.51,25.78 42.04,27.3 43.56,27.3 43.9,27.65 44.96,27.65 C20.1 | v44.2,21.97 43.4,22.77 42.58,22.77 | v56.39,20.83 56.39,19.05 45.34,8 U2.A2
  Bottom 0.254: P3.3 83.82,15.37 82.93,16.26 82.93,24 79.12,27.81 66.67,27.81 59.18,20.32 56.9,20.32 v56.39,20.83 56.26,20.83 55.5,21.59 51.44,21.59 50.29,20.45 46.23,20.45 44.7,21.97 v44.2,21.97
P3.3  (via drill 0.38)
  Top 0.254: U1.47 42.81,23.24 44.58,23.24 v45.21,22.61 | v57.66,21.34 57.66,19.3 47.88,9.53 U2.A3
  Bottom 0.254: P3.4 88.01,16.64 84.71,16.64 83.44,17.91 83.44,24.26 79.38,28.32 66.42,28.32 58.93,20.83 58.17,20.83 v57.66,21.34 56.77,22.23 51.18,22.23 50.04,21.08 46.74,21.08 v45.21,22.61
P3.4  (via drill 0.38)
  Top 0.254: U1.48 43.01,23.75 45.59,23.75 v46.74,22.61 | v57.91,22.73 58.99,21.65 58.99,19.37 50.42,10.79 U2.A4
  Bottom 0.254: P3.5 84.96,17.91 83.95,18.92 83.95,24.51 79.63,28.83 66.17,28.83 60.07,22.73 v57.91,22.73 57.78,22.86 50.8,22.86 49.66,21.72 47.62,21.72 v46.74,22.61
P3.5  (via drill 0.38)
  Top 0.254: U1.49 43.21,24.26 46.74,24.26 v48.39,22.61 | v58.67,24 59.82,22.86 59.82,19.05 52.96,12.19 U2.A5
  Bottom 0.254: P3.6 88.01,19.18 85.34,19.18 84.45,20.07 84.45,24.77 79.88,29.34 65.91,29.34 60.58,24 v58.67,24 57.4,24 56.9,23.5 50.55,23.5 49.66,22.61 v48.39,22.61
P3.6  (via drill 0.38)
  Top 0.254: U1.51 43.92,29.59 v44.7,29.59
  Bottom 0.254: v44.7,29.59 45.59,28.7 48.9,28.7 52.58,32.38 57.78,32.38 60.33,29.84 80.14,29.84 84.96,25.02 84.96,21.08 85.6,20.45 P3.7
P3.7  (via drill 0.38)
  Top 0.254: v46.23,29.59 45.34,30.48 44.1,30.48 U1.52
  Bottom 0.254: v46.23,29.59 49.02,29.59 52.32,32.89 58.04,32.89 60.58,30.35 80.39,30.35 85.47,25.27 85.47,22.35 86.11,21.72 88.01,21.72 P3.8
P4.0  (via drill 0.38)
  Top 0.254: U1.69 39.7,38.1 42.42,38.1 v43.31,38.99 | v66.8,38.1 66.8,38.99 65.02,40.77 P4.1
  Bottom 0.254: v43.31,38.99 44.58,40.26 59.56,40.26 62.48,37.34 66.04,37.34 v66.8,38.1
P4.1  (via drill 0.38)
  Top 0.254: v41.91,38.99 39.88,38.99 U1.70
  Bottom 0.254: v41.91,38.99 43.69,40.77 60.33,40.77 62.74,38.35 64.52,38.35 66.8,40.64 P4.2
P4.2
  Top 0.254: U1.80 28.19,37.15 28.19,43.94 29.72,45.47 54.99,45.47 56.52,43.94 61.34,43.94 61.98,43.31 P4.3
P4.3
  Top 0.254: P4.4 65.53,44.58 62.48,44.58 62.36,44.45 56.77,44.45 55.24,45.97 29.46,45.97 27.69,44.2 27.69,36.95 U1.81
P4.4
  Top 0.254: U1.82 27.18,36.76 27.18,44.45 29.21,46.48 55.5,46.48 57.02,44.96 61.59,44.96 62.48,45.85 P4.5
P4.5
  Top 0.254: U1.83 26.67,36.56 26.67,44.7 28.96,46.99 55.75,46.99 57.28,45.47 60.83,45.47 62.48,47.12 65.53,47.12 P4.6
P4.6
  Top 0.254: U1.84 26.16,36.36 26.16,44.96 28.7,47.5 56.01,47.5 57.53,45.97 60.07,45.97 62.48,48.39 P4.7
P4.7
  Top 0.254: U1.85 28.13,33.72 25.65,36.2 25.65,38.44 C14.1
P5.0  (via drill 0.38)
  Top 0.254: U1.16 23.62,15.66 v23.62,15.11
  Bottom 0.254: v23.62,15.11 23.62,10.92 24.64,9.91 56.52,9.91 57.78,11.18 62.23,11.18 63.63,9.78 73.15,9.78 76.2,12.83 P5(3.3V).1
P5.1  (via drill 0.38)
  Top 0.254: U1.17 24.51,15.84 v24.51,14.1
  Bottom 0.254: v24.51,14.1 24.51,11.43 25.53,10.41 56.26,10.41 57.53,11.68 62.48,11.68 63.88,10.29 72.9,10.29 76.71,14.1 79.12,14.1 P5(3.3V).2
P5.2  (via drill 0.38)
  Top 0.254: U1.18 25.4,16.02 v25.4,15.11
  Bottom 0.254: v25.4,15.11 25.4,11.81 26.29,10.92 56.01,10.92 57.28,12.19 62.74,12.19 64.14,10.79 72.64,10.79 74.42,12.57 74.42,14.35 75.44,15.37 P5(3.3V).3
P5.3  (via drill 0.38)
  Top 0.254: U1.19 26.29,16.2 v26.29,14.1
  Bottom 0.254: v26.29,14.1 26.29,12.19 27.05,11.43 55.75,11.43 57.02,12.7 62.99,12.7 64.39,11.3 72.39,11.3 73.91,12.83 73.91,15.62 74.93,16.64 79.12,16.64 P5(3.3V).4
P5.4  (via drill 0.38)
  Top 0.254: U1.31 38.36,16.38 v39.88,16.38
  Bottom 0.254: v39.88,16.38 40.26,16 53.47,16 54.74,17.27 60.71,17.27 68.2,24.77 72.52,24.77 73.66,23.62 73.66,18.67 74.42,17.91 P5(3.3V).5
P5.5  (via drill 0.38)
  Top 0.254: v38.86,17.27 38.17,17.27 U1.32
  Bottom 0.254: 39.24,17.27 v38.86,17.27 40.51,17.27 41.27,16.51 53.21,16.51 54.48,17.78 60.45,17.78 67.94,25.27 72.77,25.27 74.17,23.88 74.17,20.19 75.18,19.18 79.12,19.18 P5(3.3V).6
P5.6  (via drill 0.38)
  Top 0.254: 36.7,19.43 U1.33 37.99,18.16 v39.88,18.16
  Bottom 0.254: v39.88,18.16 40.64,18.16 41.78,17.02 52.96,17.02 54.23,18.29 60.2,18.29 67.69,25.78 73.03,25.78 74.68,24.13 74.68,21.72 75.95,20.45 P5(3.3V).7
P5.7  (via drill 0.38)
  Top 0.254: v38.61,19.05 37.81,19.05 U1.34
  Bottom 0.254: v38.61,19.05 40.64,19.05 42.16,17.53 52.7,17.53 53.98,18.8 59.94,18.8 67.44,26.29 73.66,26.29 75.44,24.51 75.44,23.24 76.96,21.72 79.12,21.72 P5(3.3V).8
P6.0  (via drill 0.38)
  Top 0.254: U1.89 24.95,34.04 23.88,34.04 19.68,38.23 19.68,41.02 v20.32,41.66
  Bottom 0.254: v20.32,41.66 22.1,43.43 29.97,43.43 33.91,47.37 35.43,47.37 37.72,49.66 U2.D6
P6.1  (via drill 0.38)
  Top 0.254: v18.8,41.66 18.8,38.35 23.62,33.53 24.75,33.53 U1.90
  Bottom 0.254: v18.8,41.66 21.08,43.94 29.21,43.94 35.18,49.91 U2.D7
P6.2  (via drill 0.38)
  Top 0.254: v17.14,41.66 17.14,39.24 23.37,33.02 24.55,33.02 U1.91
  Bottom 0.254: v17.14,41.66 19.94,44.45 26.92,44.45 31.37,48.9 U2.D8
P6.3  (via drill 0.38)
  Top 0.254: v15.24,41.66 15.24,40.39 23.11,32.51 24.38,32.51 25.53,31.37 25.53,31.34 U1.92
  Bottom 0.254: v15.24,41.66 18.54,44.96 25.4,44.96 28.83,48.39 U2.D9
P6.4  (via drill 0.38)
  Top 0.254: U1.6 23.62,22.73 v22.48,22.73
  Bottom 0.254: U2.D10 26.29,48.01 24.13,45.85 18.16,45.85 14.35,42.04 14.35,40.26 19.81,34.8 19.81,27.43 21.97,25.27 21.97,23.24 v22.48,22.73
P6.5  (via drill 0.38)
  Top 0.254: v32.51,24.38 29.84,24.38 29.34,24.89 26.49,24.89 U1.7 23.44,21.84 21.84,21.84 v21.08,22.61
  Bottom 0.254: U2.D11 23.75,48.77 22.1,47.12 18.67,47.12 13.84,42.29 13.84,40.01 18.29,35.56 18.29,30 19.3,28.99 19.3,26.54 21.08,24.77 v21.08,22.61 | ICSP.4 54.23,29.46 52.32,29.46 50.04,27.18 50.04,27.05 47.37,24.38 35.69,24.38 35.18,23.88 33.66,23.88 33.15,24.38 v32.51,24.38
P6.6  (via drill 0.38)
  Top 0.254: v19.56,22.61 21.34,20.83 23.13,20.83 U1.8 26.69,24.38 29.08,24.38 29.97,23.5 33.4,23.5 v34.67,24.77
  Bottom 0.254: U2.D12 21.21,50.55 13.34,42.67 13.34,39.75 16.76,36.32 16.76,28.19 19.56,25.4 v19.56,22.61 | ICSP.1 52.45,30.73 49.4,27.69 49.4,27.18 47.12,24.89 34.8,24.89 v34.67,24.77
P6.7  (via drill 0.38)
  Top 0.254: v18.16,22.61 20.7,20.07 23.08,20.07 U1.9 26.89,23.88 28.7,23.88 29.59,22.99 35.81,22.99 v36.2,23.37
  Bottom 0.254: U2.D13 18.67,48.77 12.83,42.93 12.83,39.5 16.13,36.2 16.13,27.94 18.16,25.91 v18.16,22.61 | ICSP.3 51.94,28.19 47.62,23.88 38.23,23.88 37.72,23.37 v36.2,23.37
P12.0  (via drill 0.38)
  Top 0.254: v39.62,28.32 40.13,27.81 40.73,27.81 U1.53 | USR_LED1.A 93.99,52.32 85.72,52.32 v84.2,50.8 | P12.1 79.12,42.04 81.41,42.04 81.92,42.55 81.92,46.48 v83.82,48.39
  Bottom 0.254: v39.62,28.32 40.39,28.32 43.56,31.5 48.39,31.5 51.31,34.42 58.8,34.42 60.96,32.26 73.66,32.26 77.85,36.45 P12.1 | v83.82,48.39 83.82,50.42 v84.2,50.8
P12.1  (via drill 0.38)
  Top 0.254: v38.73,29.34 39.88,29.34 40.51,28.7 40.91,28.7 U1.54
  Bottom 0.254: v38.73,29.34 40.64,29.34 43.31,32 48.13,32 51.05,34.92 56.52,34.92 58.04,34.92 59.05,34.92 60.83,33.15 63.25,33.15 63.63,32.77 73.41,32.77 76.33,35.69 76.33,41.53 76.83,42.04 79.12,42.04 P12.2
P12.2  (via drill 0.38)
  Top 0.254: U1.67 39.34,36.32 40.64,36.32 41.91,37.59 44.45,37.59 v45.59,38.73 | v73.91,43.31 P12.3
  Bottom 0.254: v45.59,38.73 46.1,39.24 54.74,39.24 56.9,37.08 58.42,37.08 61.34,34.16 62.99,34.16 63.88,33.27 73.15,33.27 75.82,35.94 75.82,42.55 76.58,43.31 P12.3 | U2.RX 52.96,49.53 57.91,44.58 72.52,44.58 73.79,43.31 v73.91,43.31
P12.3  (via drill 0.38)
  Top 0.254: U1.68 39.52,37.21 v40.13,37.21
  Bottom 0.254: P12.4 79.12,44.58 76.71,44.58 75.31,43.18 75.31,41.78 75.25,41.72 | v40.13,37.21 42.8,37.21 45.34,39.75 54.99,39.75 56.52,38.23 58.04,38.23 61.09,35.18 62.74,35.18 64.14,33.78 72.9,33.78 75.31,36.2 75.31,41.66 75.25,41.72 | 75.25,41.72 74.93,42.04 56.13,42.04 50.42,47.75 U2.TX
P12.4  (via drill 0.38)
  Top 0.254: U1.4 25.64,26.16 27.69,26.16 v28.7,27.18 | U2.SCL 10.79,48.77 44.07,48.77 v44.45,48.39 44.83,48.01 57.28,48.01 58.29,46.99 60.2,46.99 62.87,49.66 68.33,49.66 70.23,47.75 75.95,47.75 P12.5
  Bottom 0.254: v28.7,27.18 29.84,28.32 31.5,28.32 33.15,29.97 33.15,31.5 38.48,36.83 38.48,37.72 44.45,43.69 v44.45,48.39
P12.5  (via drill 0.38)
  Top 0.254: U1.5 25.84,25.65 28.7,25.65 v28.96,25.91 | v74.42,45.72 75.56,44.58 79.12,44.58 P12.6 | U2.SDA 12.83,49.28 45.72,49.28 v45.97,49.02 46.48,48.51 56.52,48.51 57.28,48.51 58.42,48.51 v58.8,48.13
  Bottom 0.254: v74.42,45.72 73.03,47.12 59.82,47.12 v58.8,48.13 | v28.96,25.91 29.97,26.92 30.99,26.92 33.91,29.84 33.91,31.5 38.99,36.58 38.99,37.47 45.97,44.45 v45.97,49.02
P12.6  (via drill 0.38)
  Top 0.254: U1.29 34.04,19.29 v34.04,19.68 | v55.37,49.4 55.12,49.15 49.78,49.15 U2.D2
  Bottom 0.254: v34.04,19.68 34.04,20.83 30.99,23.88 30.99,25.02 33.78,27.81 34.04,27.81 34.16,27.81 36.07,27.81 36.7,27.18 40.01,27.18 43.81,30.99 48.77,30.99 51.69,33.91 58.55,33.91 61.09,31.37 73.53,31.37 81.92,39.75 81.92,46.48 81.28,47.12 79.25,47.12 P12.7 69.6,48.39 68.33,49.66 59.56,49.66 59.31,49.4 v55.37,49.4
P12.7  (via drill 0.38)
  Top 0.254: U1.30 34.92,19.11 34.92,20.07 35.18,20.32 v35.18,20.45
  Bottom 0.254: v35.18,20.45 31.5,24.13 31.5,24.77 34.04,27.3 35.69,27.3 36.32,26.67 40.26,26.67 44.07,30.48 49.15,30.48 52.07,33.4 58.29,33.4 60.83,30.86 73.79,30.86 82.55,39.62 82.55,47.5 81.66,48.39 P12.8 79.12,49.66 70.23,49.66 67.56,52.32 54.48,52.32 54.23,52.58 46.86,52.58 U2.D3
P15.4  (via drill 0.38)
  Top 0.254: U1.93 26.31,29.84 v28.45,29.84
  Bottom 0.254: U2.D4 42.8,46.99 41.02,45.21 35.31,45.21 33.53,43.43 33.53,34.67 31.88,33.02 31.88,29.59 31.24,28.96 30.86,28.96 29.97,29.84 v28.45,29.84
P15.5  (via drill 0.38)
  Top 0.254: U1.94 25.91,29.54 25.91,29.21 26.29,28.83 v26.67,28.83
  Bottom 0.254: U2.D5 40.26,46.86 39.12,45.72 35.05,45.72 33.02,43.69 33.02,35.43 31.88,34.29 30.99,34.29 27.18,30.48 27.18,29.34 v26.67,28.83
RPI_RXD  (via drill 0.38)
  Top 0.254: U1.25 30.61,16.28 30.61,15.75 31.11,15.24 v31.75,15.24 | P1(3.3V).6 74.3,15.11 74.3,13.08 76.96,10.41 v76.96,10.29
  Bottom 0.254: v31.75,15.24 34.54,15.24 35.31,14.48 54.23,14.48 55.5,15.75 62.23,15.75 65.66,19.18 70.23,19.18 P1(3.3V).6 | RPI_GPIO.17 76.96,8.64 v76.96,10.29
RPI_SCL(1.7)  (via drill 0.38)
  Top 0.254: U1.28 36.11,16.51 v36.96,16.51 | RPI_GPIO.22 67.94,4.7 67.94,9.27 65.91,11.3 65.91,17.14 67.44,18.67 68.07,18.67 68.58,19.18 70.23,19.18 P1(3.3V).8
  Bottom 0.254: v36.96,16.51 37.97,15.49 53.72,15.49 54.99,16.76 61.72,16.76 66.67,21.72 70.23,21.72 P1(3.3V).8
RPI_SDA(1.6)  (via drill 0.38)
  Top 0.254: U1.27 36.2,15.72 v36.2,15.49 | RPI_GPIO.24 65.41,4.7 65.41,17.91 66.67,19.18 67.69,19.18 P1(3.3V).7
  Bottom 0.254: v36.2,15.49 36.7,14.99 53.98,14.99 55.24,16.26 61.98,16.26 66.17,20.45 P1(3.3V).7
RPI_TXD  (via drill 0.38)
  Top 0.254: 30.35,18.16 U1.22 28.96,16.75 28.96,13.84 29.46,13.34 v30.86,13.34 | RPI_GPIO.19 70.36,7.37 69.09,7.37 68.45,8 68.45,9.53 66.42,11.56 66.42,13.97 67.18,14.73 68.33,14.73 P1(3.3V).3
  Bottom 0.254: v30.86,13.34 31.24,12.95 54.99,12.95 56.26,14.22 62.99,14.22 64.14,15.37 P1(3.3V).3
TCK_SWDCK  (via drill 0.38)
  Top 0.254: U1.21 28.07,16.57 v28.07,14.1 | RPI_GPIO.4 90.81,4.7 88.65,4.7 88.27,5.08 88.27,8 88.01,8.26 74.68,8.26 71.5,11.43 P1(3.3V).2
  Bottom 0.254: v28.07,14.1 28.07,13.08 28.7,12.45 55.24,12.45 56.52,13.72 63.25,13.72 63.63,14.1 70.23,14.1 P1(3.3V).2 | RPI_GPIO.4 90.81,4.7 90.81,11.56 94.61,15.37 MINIPROG.2
TMS_SWDIO  (via drill 0.38)
  Top 0.254: U1.20 27.18,16.39 v27.18,15.11 | RPI_GPIO.3 89.28,8.76 75.18,8.76 72.9,11.05 72.9,13.72 72.52,14.1 70.87,14.1 69.6,12.83 P1(3.3V).1
  Bottom 0.254: v27.18,15.11 27.18,12.57 27.81,11.94 55.5,11.94 56.77,13.21 63.25,13.21 63.63,12.83 P1(3.3V).1 | MINIPROG.1 95.76,9.65 RPI_GPIO.3
VCCA
  Top 0.254: U1.63 39.37,33.53 40.33,33.53 C9.1
VCCD  (via drill 0.38)
  Top 0.254: C3.1 41.91,18.92 40.01,20.83 39.57,20.83 U1.39 37.59,22.8 37.59,23.5 v34.67,26.42 v30.99,30.1 | v29.59,31.5 27.78,33.31 U1.86
  Bottom 0.254: v30.99,30.1 v29.59,31.5
VRPI
  Bottom 1.016: RPI_GPIO.25 63.25,5.08 23.11,5.08 22.35,5.84 22.35,6.86 21.08,8.13 13.72,8.13 11.05,10.79 JP1.1
VUSB
  Top 0.406: USB.1 6,8.16 6.22,8.38
  Top 0.61: 6.22,8.38 6.48,8.64 6.48,12.19 5.97,12.7 JP1.3
XRES  (via drill 0.38)
  Top 0.254: U1.15 25.89,18.64 | 25.89,18.64 22.61,15.35 v22.61,13.97 | v24,7.24 22.48,5.71 U2.RES | R5.1 25.89,18.64
  Bottom 0.254: 24,9.4 23.62,9.4 22.61,10.41 v22.61,13.97 | 24,9.4 62.99,9.4 63.12,9.27 73.53,9.27 75.69,11.43 89.53,11.43 89.79,11.43 89.92,11.43 90.68,12.19 90.68,14.48 90.81,14.61 | 24,9.4 v24,7.24 | 90.81,14.61 94.11,17.91 MINIPROG.3 | RST.3 90.81,26.11 90.81,14.61

### Text on the board
bPlace: Revision E
tNames: LED | PWR | NC | - | PROG | NC | GND | P6.7 | P6.6 | P6.5 | P6.4 | P6.3 | P6.2 | P6.1 | P6.0 | P12.4 | P12.5 | P15.5 | P15.4 | P12.7 | P12.6 | P12.3 | P12.2 | + | GND | P2.1 | P2.0 | RUN | GND | P6.6 | 5.0V | P6.7 | P6.5 | GND | P12.0 | + | - | R | USB | Pi | C | 10 PIN / CONFIG | D | 14 | 26 | RST | 3.3V | 5.0V | GND | GND | NC | P3.0 | P3.1 | P3.2 | P3.3 | P3.4 | P3.5 | 2 | 1 | 25 | 13
bNames: SCL | SDA | GND | 13 | 12 | 11 | 10 | 9 | 8 | 7 | 6 | 5 | 4 | 3 | 2 | 1 | 0 | IOREF | RST | 3.3V | 5.0V | GND | GND | A0 | A1 | A2 | A3 | A4 | A5 | Raspberry Pi | 26 | 13 | 2 | 1 | 25 | 14